# EasyEDA Pro project ProPrj_逆变电路（单相三相）_2026-01-25.epro, board PCB1_1
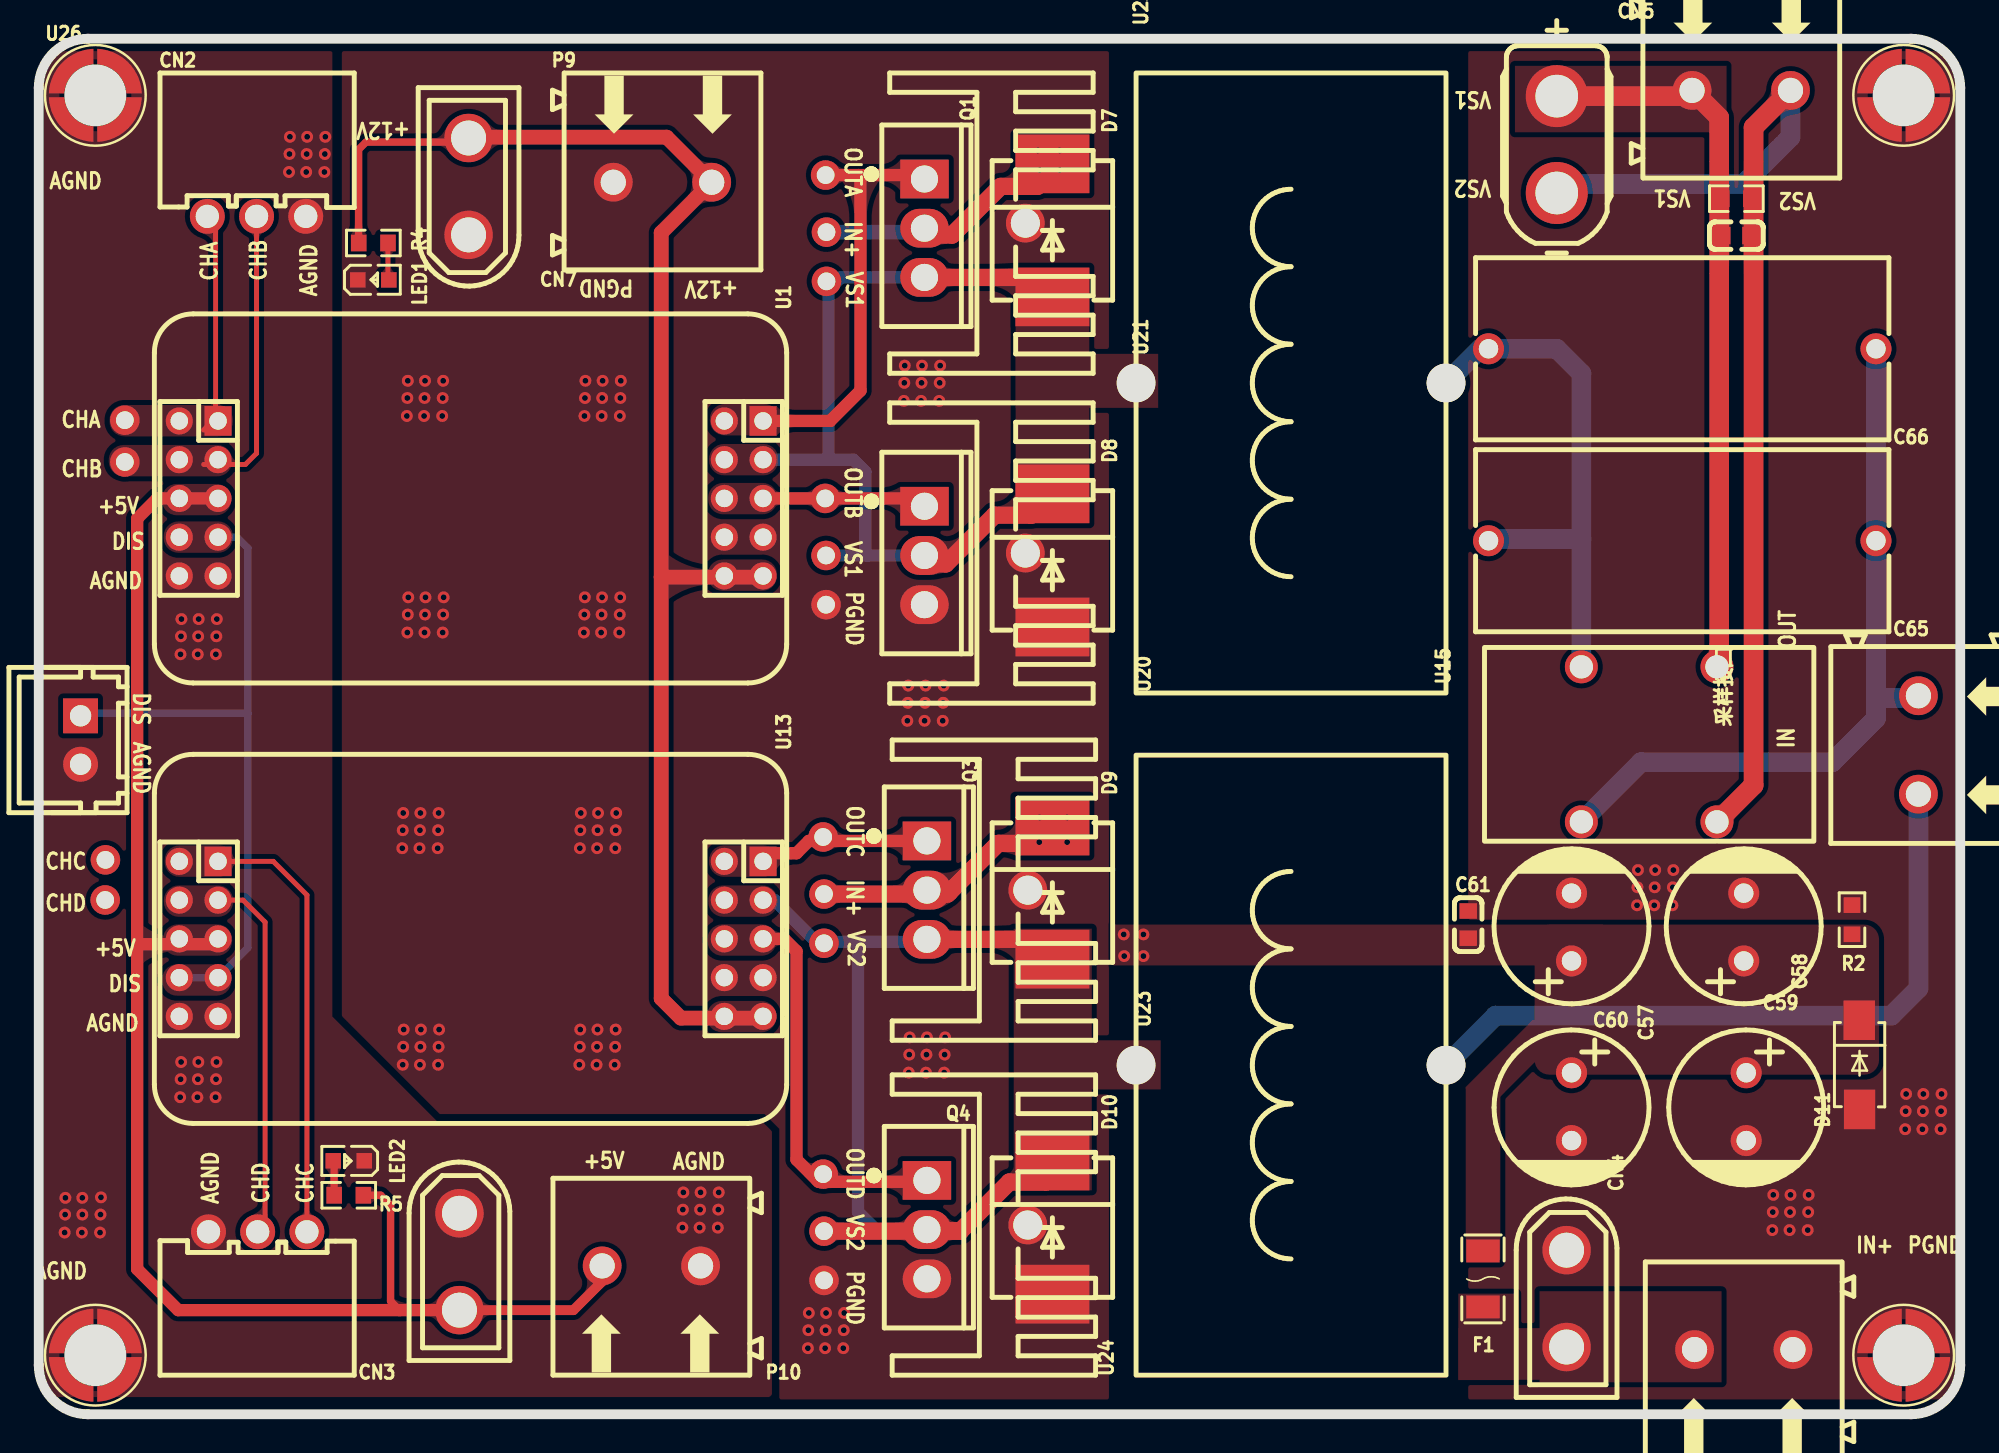
[diagram p5: board, top side]
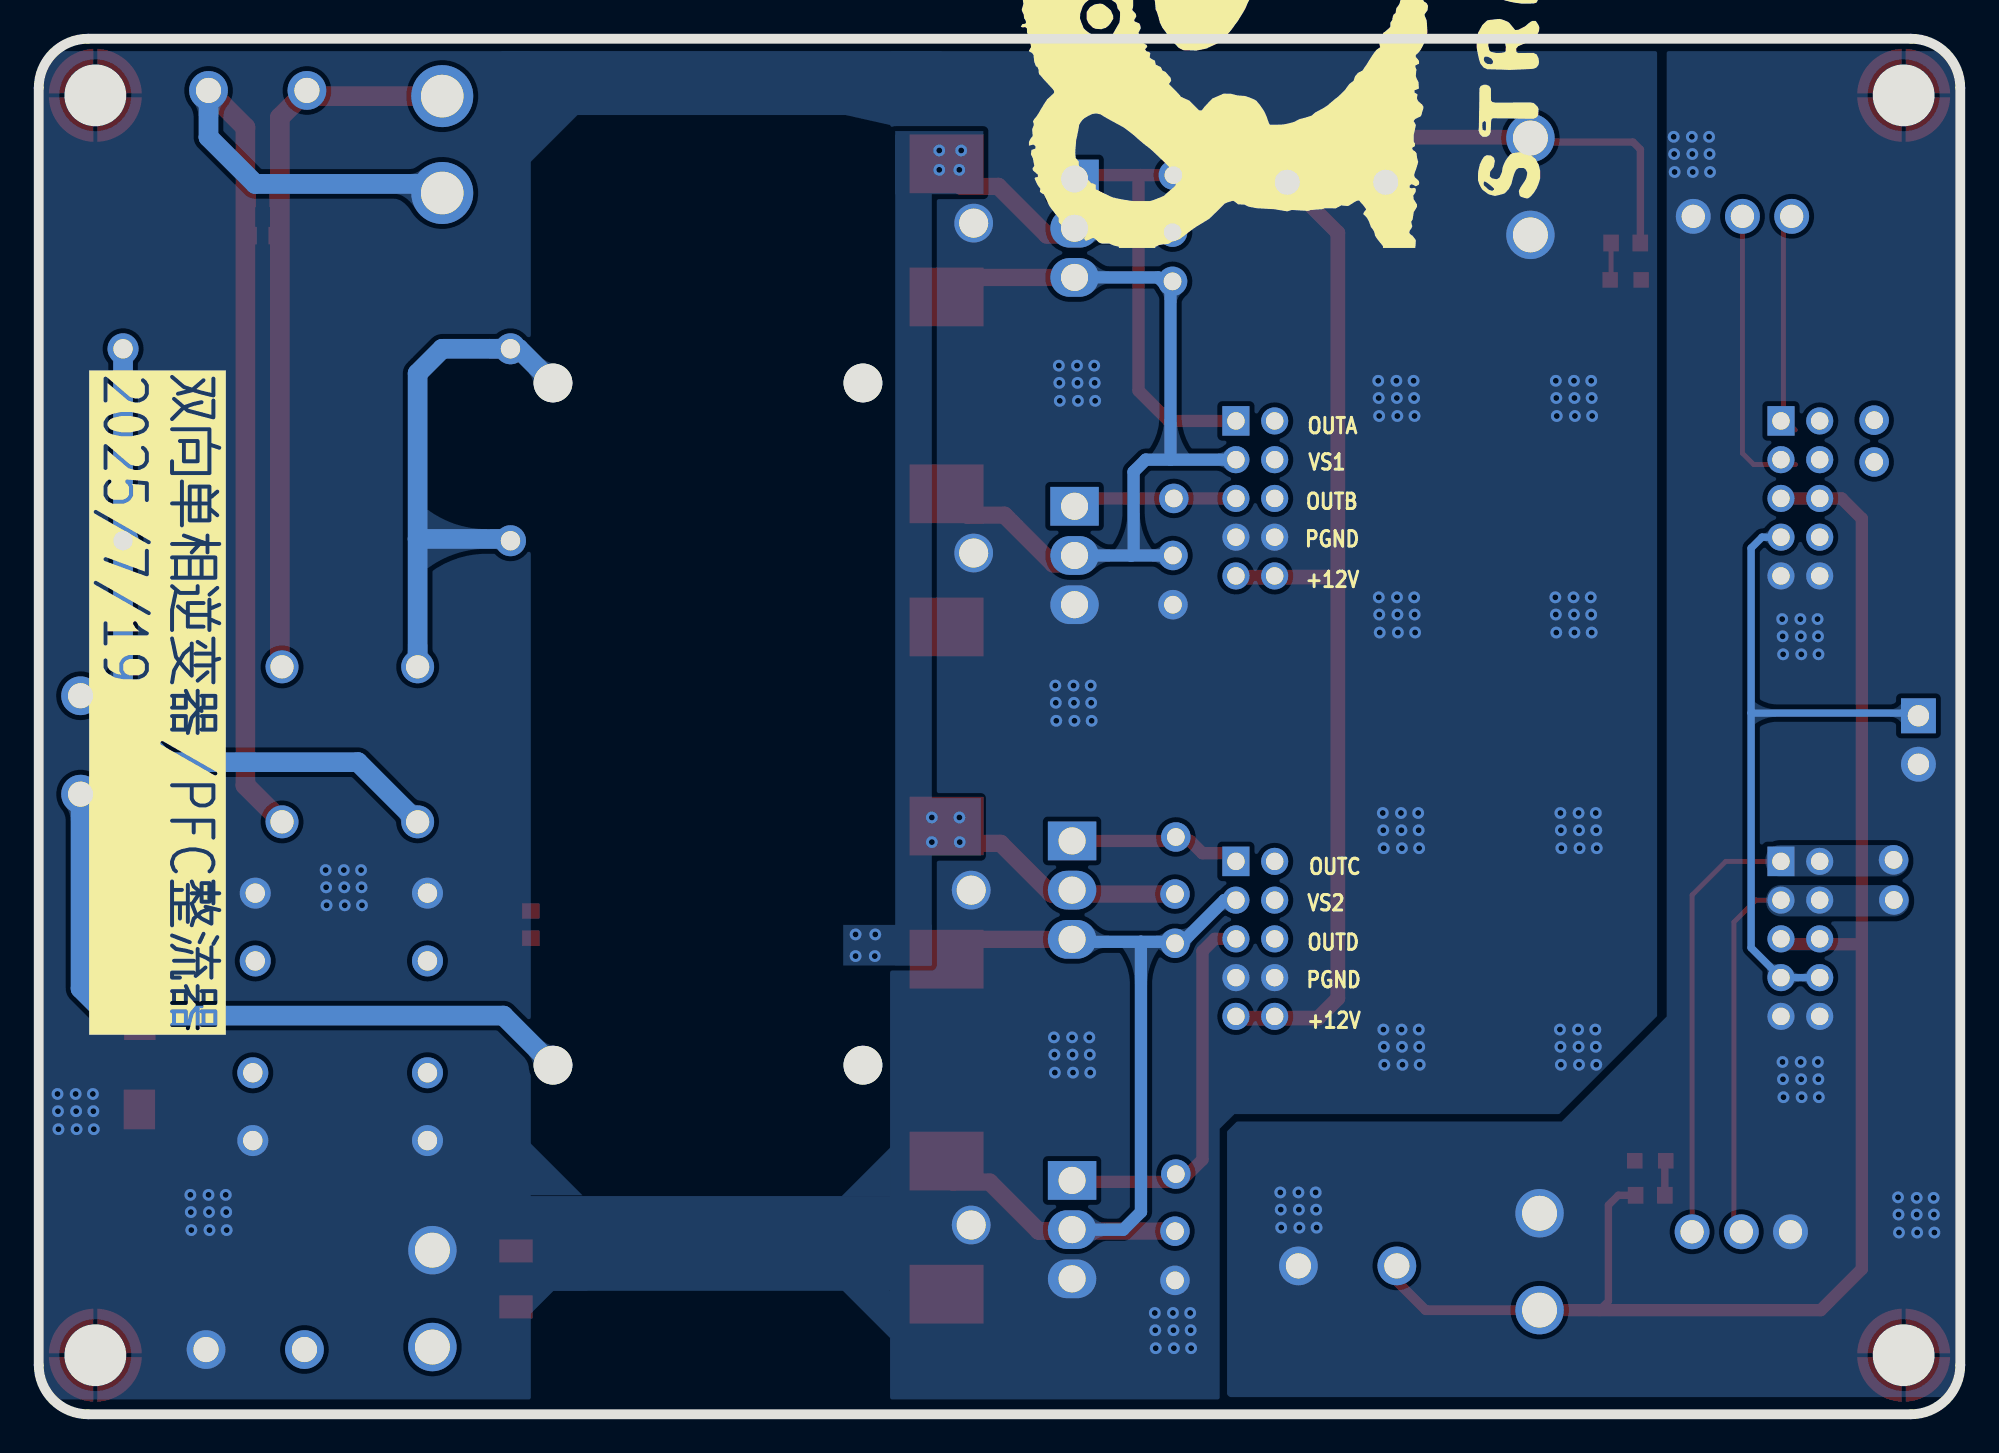
[diagram p6: board, bottom side, seen from below]

Outline 99.19 x 70.99 mm; copper layers: Top Layer, Bottom Layer. Coordinates in mm from the lower left corner of the outline.
Outline path: 0,68.45 0,2.54 arc(0.74,0.74) 2.54,0 96.65,0 arc(98.44,0.74) 99.19,2.54 99.19,68.45 arc(98.44,70.25) 96.65,70.99 2.54,70.99 arc(0.74,70.25) 0,68.45
Stack: Top Layer 0.035mm / Dielectric1 1.51mm FR4 er 4.5 / Bottom Layer 0.035mm

## Design rules (mm)
template: 自定义配置
spacing copperThickness1oz (default): track to track 0.102, other pairs 0.152 to 0.3
spacing copperThickness2oz: track to track 0.203, other pairs 0.152 to 0.3
track width copperThickness1oz (default): min 0.127, default 0.254, max 2.54
track width copperThickness2oz: min 0.203, default 0.254, max 2.54
differential pair differentialPair (default): width min 0.127, default 0.254, max 2.54; gap min 0.152, default 0.152
via viaSize (default): diameter min 0.5, default 0.61, max 10; hole min 0.3, default 0.305, max 6.3

## Placement (name value [footprint] x y rotation side)
C57  470uF  [CAP-TH_BD8.0-P3.50-D0.6-FD_1]  79.12 15.88 270 top
C58  470uF  [CAP-TH_BD8.0-P3.50-D0.6-FD_1]  88.14 15.88 270 top
C59  470uF  [CAP-TH_BD8.0-P3.50-D0.6-FD_1]  88.01 25.15 90 top
C60  470uF  [CAP-TH_BD8.0-P3.50-D0.6-FD_1]  79.12 25.15 90 top
C61  100nF  [C0603]  73.79 25.27 270 top
C64  100nF  [C0603]  87.63 60.83 180 top
C65  2.2uF  [CAP-TH_L21.3-W9.4-P20.00-D1.2]  84.84 45.09 180 top
C66  2.2uF  [CAP-TH_L21.3-W9.4-P20.00-D1.2]  84.84 54.99 180 top
CN2  XH-3AW  [CONN-TH_3P-P2.54_HCTL_XH-3AW]  11.24 61.83 0 top
CN3  XH-3AW  [CONN-TH_3P-P2.54_HCTL_XH-3AW]  11.3 9.42 180 top
CN4  XT30UPB-M  [CONN-TH_XT30UPB-M]  78.87 5.97 270 top
CN5  XT30UPB-F30.G.Y  [CONN-TH_XT30UPB-F]  78.36 65.53 270 top
CN6  ZX-XH2.54-2PZZ  [CONN-TH_2P-P2.50_HX25003-2A]  2.16 34.8 270 top
CN7  XT30UPB-M  [CONN-TH_XT30UPB-M]  22.19 63.37 90 top
CN8  XT30UPB-M  [CONN-TH_XT30UPB-M]  21.72 7.87 270 top
D7  SS510  [SMC_L7.1-W6.2-LS8.1-R-RD]  52.32 61.1 270 top
D8  SS510  [SMC_L7.1-W6.2-LS8.1-R-RD]  52.32 44.07 270 top
D9  SS510  [SMC_L7.1-W6.2-LS8.1-R-RD]  52.32 26.92 270 top
D10  SS510  [SMC_L7.1-W6.2-LS8.1-R-RD]  52.32 9.63 270 top
D11  SS54  [SMA_L4.3-W2.6-LS5.0-FD]  93.98 18.03 90 top
F1  JFC1206-1500FS  [F1206]  74.55 6.99 90 top
LED1  LTST-C190KSKT  [LED0603-RD]  17.27 58.55 0 top
LED2  LTST-C190KSKT  [LED0603-RD]  16 13.08 180 top
NOREF  -  [Pad_e745]  40.54 24.31 0 top
NOREF#2  -  [Pad_e744]  40.54 26.85 0 top
NOREF#3  -  [Pad_e807]  40.66 58.47 0 top
NOREF#4  -  [Pad_e743]  40.49 29.79 0 top
NOREF#5  -  [Pad_e645]  40.6 47.27 0 top
NOREF#6  -  [Pad_e806]  40.66 61.01 0 top
NOREF#7  -  [Pad_e835]  4.45 51.31 0 top
NOREF#8  -  [Pad_e790]  40.49 12.39 0 top
NOREF#9  -  [Pad_e876]  3.43 26.54 0 top
NOREF#10  -  [Pad_e658]  40.64 44.32 0 top
NOREF#11  -  [Pad_e805]  40.62 63.96 0 top
NOREF#12  -  [Pad_e741]  40.64 41.78 0 top
NOREF#13  -  [Pad_e791]  40.54 9.45 0 top
NOREF#14  -  [Pad_e836]  4.45 49.15 0 top
NOREF#15  -  [Pad_e875]  3.44 28.61 0 top
NOREF#16  -  [Pad_e792]  40.54 6.91 0 top
P7  WJ500V-5.08-2P  [CONN-TH_2P-P5.00_WJ500V-5.08-2P]  87.88 68.33 0 top
P8  WJ500V-5.08-2P  [CONN-TH_2P-P5.00_WJ500V-5.08-2P]  88.01 3.34 180 top
P9  WJ500V-5.08-2P  [CONN-TH_2P-P5.00_WJ500V-5.08-2P]  32.2 63.59 0 top
P10  WJ500V-5.08-2P  [CONN-TH_2P-P5.00_WJ500V-5.08-2P]  31.62 7.66 180 top
P11  WJ500V-5.08-2P  [CONN-TH_2P-P5.00_WJ500V-5.08-2P]  97.03 34.54 270 top
Q1  IRF540  [TO-220AB-3_L10.4-W4.6-P2.54-L]  45.72 61.21 270 top
Q2  IRF540  [TO-220AB-3_L10.4-W4.6-P2.54-L]  45.72 44.32 270 top
Q3  IRF540  [TO-220AB-3_L10.4-W4.6-P2.54-L]  45.85 27.05 270 top
Q4  IRF540  [TO-220AB-3_L10.4-W4.6-P2.54-L]  45.85 9.53 270 top
R2  100kΩ  [R0603]  93.6 25.53 270 top
R3  100kΩ  [R0603]  87.63 62.74 180 top
R4  5kΩ  [R0603]  17.27 60.45 0 top
R5  5kΩ  [R0603]  16 11.3 180 top
U1  -  [UCC21520模块]  23.5 47.12 270 top
U13  -  [UCC21520模块]  23.5 24.38 270 top
U14  -  [1mH_14*8*7]  64.64 53.23 90 top
U15  -  [共模电感3mH]  79.63 36.58 0 top
U20  15.5*10.5*21  [SINK-TH_L15.0-W10.5-H21.0]  51.05 27.05 270 top
U21  15.5*10.5*21  [SINK-TH_L15.0-W10.5-H21.0]  50.93 44.45 270 top
U22  15.5*10.5*21  [SINK-TH_L15.0-W10.5-H21.0]  50.93 61.48 270 top
U23  15.5*10.5*21  [SINK-TH_L15.0-W10.5-H21.0]  51.05 9.77 270 top
U24  -  [1mH_14*8*7]  64.64 18.02 90 top
U25  M3x10+6Cu  [SMD_L4.7-W4.7-D3.0]  2.92 3.05 0 top
U26  M3x10+6Cu  [SMD_L4.7-W4.7-D3.0]  2.92 68.07 0 top
U27  M3x10+6Cu  [SMD_L4.7-W4.7-D3.0]  96.27 3.05 0 top
U28  M3x10+6Cu  [SMD_L4.7-W4.7-D3.0]  96.27 68.07 0 top

## Footprints (pads in the part's own frame, mm; a bottom-side part is the same pattern mirrored in y, then rotated)
1mH_14*8*7
  round 2 hole 2x1.5: 1(0,8) 2(0,-8)
C0603
  rect 0.8x0.9 smd: 1(-0.7,0) 2(0.7,0)
CAP-TH_BD8.0-P3.50-D0.6-FD_1
  round 1.6 hole 1: 1(-1.75,0) 2(1.75,0)
CAP-TH_L21.3-W9.4-P20.00-D1.2
  round 1.6 hole 1: 1(-10,0) 2(10,0)
CONN-TH_2P-P2.50_HX25003-2A
  rect 1.8x1.8 hole 1.1: 1(-1.25,0)
  round 1.8 hole 1.1: 2(1.25,0)
CONN-TH_2P-P5.00_WJ500V-5.08-2P
  round 2 hole 1.3: 1(-2.54,0) 2(2.54,0)
CONN-TH_3P-P2.54_HCTL_XH-3AW
  round 1.8 hole 1.199: 1(-2.54,0) 2(0.002,0) 3(2.54,0)
CONN-TH_XT30UPB-F
  round 3.2 hole 2.2: 1(-2.5,0) 2(2.5,0)
CONN-TH_XT30UPB-M
  round 2.5 hole 1.8: 1(-2.5,0) 2(2.5,0)
F1206
  rect 1.19x1.728 smd: 1(-1.445,0) 2(1.445,0)
LED0603-RD
  rect 0.8x0.8 smd: 1(-0.799,0) 2(0.799,0)
Pad_e645
  round 1.524 hole 0.914: 1(0,0)
Pad_e658
  round 1.524 hole 0.914: 1(0,0)
Pad_e741
  round 1.524 hole 0.914: 1(0,0)
Pad_e743
  round 1.524 hole 0.914: 1(0,0)
Pad_e744
  round 1.524 hole 0.914: 1(0,0)
Pad_e745
  round 1.524 hole 0.914: 1(0,0)
Pad_e790
  round 1.524 hole 0.914: 1(0,0)
Pad_e791
  round 1.524 hole 0.914: 1(0,0)
Pad_e792
  round 1.524 hole 0.914: 1(0,0)
Pad_e805
  round 1.524 hole 0.914: 1(0,0)
Pad_e806
  round 1.524 hole 0.914: 1(0,0)
Pad_e807
  round 1.524 hole 0.914: 1(0,0)
Pad_e835
  round 1.524 hole 0.914: 1(0,0)
Pad_e836
  round 1.524 hole 0.914: 2(0,0)
Pad_e875
  round 1.524 hole 0.914: 1(0,0)
Pad_e876
  round 1.524 hole 0.914: 2(0,0)
R0603
  rect 0.806x0.864 smd: 1(-0.753,0) 2(0.753,0)
SINK-TH_L15.0-W10.5-H21.0
  round 2 hole 1.5: 1(0,0)
SMA_L4.3-W2.6-LS5.0-FD
  rect 2.046x1.62 smd: 1(-2.304,-0.009) 2(2.304,0.009)
SMC_L7.1-W6.2-LS8.1-R-RD
  rect 3.03x3.82 smd: 1(3.435,0) 2(-3.435,0)
SMD_L4.7-W4.7-D3.0
  custom 2.3x2.3 smd: 1(-1.25,-1.528) 1(-1.25,1.528) 1(1.25,1.528) 1(1.25,-1.528)
TO-220AB-3_L10.4-W4.6-P2.54-L
  rect 2x2.5 hole 1.4: 1(-2.54,0)
  oval 2x2.5 hole 1.4: 2(0,0) 3(2.54,0)
UCC21520模块
  rect 1.524x1.4 hole 0.9: 1(-4.151,-14.24) 6(-4.151,13.895)
  round 1.4 hole 0.9: 1(-4.151,-16.24) 2(-2.151,-14.24) 2(-2.151,-16.24) 3(-0.151,-14.24) 3(-0.151,-16.24) 4(1.849,-14.24) 4(1.849,-16.24) 5(3.849,-14.24) 5(3.849,-16.24) 6(-4.151,11.895) 7(-2.151,13.895) 7(-2.151,11.895) 8(-0.151,13.895) 8(-0.151,11.895) 9(1.849,13.895) 9(1.849,11.895) 10(3.849,13.895) 10(3.849,11.895)
共模电感3mH
  round 1.7 hole 1.2: 1(0,2) 2(7,2) 3(7,-6) 4(0,-6)

## Nets
+5V: CN8.2 P10.2 R5.1 U1.3 U13.3
+12V: CN7.2 P9.2 R4.1 U1.10 U13.10
AGND: CN2.3 CN3.3 CN6.2 CN8.1 LED2.1 P10.1 U1.5 U13.5 U25.1 U26.1
PGND: C57.2 C58.2 C59.2 C60.2 C61.1 CN4.1 CN7.1 D8.1 D10.1 D11.1 LED1.1 NOREF#12.1 NOREF#16.1 P8.1 P9.1 Q2.3 Q4.3 R2.1 U1.9 U13.9 U20.1 U21.1 U22.1 U23.1 U27.1 U28.1
DIS: CN6.1 U1.4 U13.4
IN+: CN4.2 F1.1 P8.2
OUTA: NOREF#11.1 Q1.1 U1.6
OUTB: NOREF#5.1 Q2.1 U1.8
OUTC: NOREF#4.1 Q3.1 U13.6
OUTD: NOREF#8.1 Q4.1 U13.8
PWMA: CN2.1 NOREF#7.1 U1.1
PWMB: CN2.2 NOREF#14.2 U1.2
PWMC: CN3.1 NOREF#15.1 U13.1
PWMD: CN3.2 NOREF#9.2 U13.2
VS1: D7.1 D8.2 NOREF#3.1 NOREF#10.1 Q1.3 Q2.2 U1.7 U14.1
VS2: D9.1 D10.2 NOREF.1 NOREF#13.1 Q3.3 Q4.2 U13.7 U24.1
$1N14882: C57.1 C58.1 C59.1 C60.1 C61.2 D7.2 D9.2 D11.2 F1.2 NOREF#2.1 NOREF#6.1 Q1.2 Q3.2 R2.2
$1N16777: C64.2 CN5.1 P7.1 R3.2 U15.2
$1N16783: C64.1 CN5.2 P7.2 R3.1 U15.3
$1N17145: C65.2 C66.2 U14.2 U15.1
$1N25469: LED1.2 R4.2
$1N25627: LED2.2 R5.2
$1N25816: P11.2 U24.2
$1N25826: C65.1 C66.1 P11.1 U15.4

## Via types
v1: diameter 0.61, hole 0.305, Top Layer to Bottom Layer, 192 vias

## Routing (per net, layer and track width the routed paths; a pad name or vN(x,y) marks a point on that pad's centre or on a via; arc(x,y) is an arc through that point)
+5V: length 81.2
  Top Layer w0.381: 18.63,5.37 18.16,5.84 18.16,10.8 17.65,11.3 R5.1
  Top Layer w0.508: P10.2 29.08,6.86 27.6,5.37 CN8.2
  Top Layer w0.635: CN8.2 7.2,5.37 5.08,7.49 5.08,24.26 ; U1.3 U1.3 6.12,47.27 5.08,46.23 5.08,24.26 ; 5.08,24.26 8.98,24.26 U13.3
+12V: length 78.5
  Top Layer w0.381: 21.68,65.87 21.64,65.91 21.38,65.66 16.89,65.66 16.51,65.28 16.51,60.46 R4.1
  Top Layer w0.762: U1.10 37.33,43.21 32.13,43.21 ; 32.13,43.21 32.13,60.98 P9.2 32.41,65.91 21.64,65.91 ; 32.13,43.21 32.13,21.46 33.15,20.45 37.3,20.45 U13.10
AGND:
  vias: v1(1.34,9.38) v1(1.38,11.17) v1(1.36,10.31) v1(2.25,11.17) v1(2.25,10.31) v1(2.23,9.38) v1(3.21,11.2) v1(3.19,10.31) v1(3.16,9.38) v1(7.34,40.15) v1(7.32,39.22) v1(7.35,18.18) v1(7.32,17.29) v1(7.3,16.36) v1(7.37,41.04) v1(8.23,40.15) v1(8.21,39.22) v1(8.24,18.18) v1(8.21,17.29) v1(8.19,16.36) v1(8.26,41.04) v1(9.14,39.22) v1(9.15,17.29) v1(9.13,16.36) v1(9.19,41.04) v1(9.17,40.15) v1(9.17,18.18) v1(12.94,65.04) v1(12.92,64.11) v1(12.97,65.93) v1(13.83,65.04) v1(13.81,64.11) v1(13.86,65.93) v1(14.74,64.11) v1(14.79,65.93) v1(14.77,65.04) v1(33.25,10.56) v1(33.23,9.63) v1(33.27,11.45) v1(34.14,10.56) v1(34.11,9.63) v1(34.16,11.45) v1(35.05,9.63) v1(35.1,11.45) v1(35.08,10.56)
PGND:
  vias: v1(18.81,31.03) v1(18.79,30.14) v1(18.77,29.21) v1(18.84,19.86) v1(18.81,18.97) v1(18.79,18.04) v1(19.05,53.34) v1(19.03,52.45) v1(19,51.52) v1(19.05,41.28) v1(19.03,40.35) v1(19.07,42.16) v1(19.65,29.21) v1(19.7,31.03) v1(19.68,30.14) v1(19.73,19.86) v1(19.7,18.97) v1(19.68,18.04) v1(19.94,53.34) v1(19.91,52.45) v1(19.89,51.52) v1(19.94,41.28) v1(19.91,40.35) v1(19.96,42.16) v1(20.64,31.03) v1(20.62,30.14) v1(20.59,29.21) v1(20.64,18.97) v1(20.62,18.04) v1(20.66,19.86) v1(20.85,52.45) v1(20.83,51.52) v1(20.85,40.35) v1(20.88,53.34) v1(20.9,42.16) v1(20.88,41.28) v1(27.93,29.21) v1(27.95,19.86) v1(27.93,18.97) v1(27.9,18.04) v1(27.98,31.03) v1(27.96,30.14) v1(28.14,40.35) v1(28.22,53.34) v1(28.19,52.45) v1(28.17,51.52) v1(28.19,42.16) v1(28.16,41.28) v1(28.85,30.14) v1(28.82,29.21) v1(28.84,19.86) v1(28.82,18.97) v1(28.79,18.04) v1(28.87,31.03) v1(29.05,41.28) v1(29.03,40.35) v1(29.11,53.34) v1(29.08,52.45) v1(29.06,51.52) v1(29.08,42.16) v1(29.75,18.97) v1(29.73,18.04) v1(29.81,31.03) v1(29.78,30.14) v1(29.76,29.21) v1(29.78,19.86) v1(30.05,53.34) v1(30.02,52.45) v1(30,51.52) v1(30.02,42.16) v1(29.99,41.28) v1(29.97,40.35) v1(39.75,5.23) v1(39.73,4.34) v1(39.7,3.41) v1(40.64,5.23) v1(40.62,4.34) v1(40.59,3.41) v1(41.55,4.34) v1(41.53,3.41) v1(41.58,5.23) v1(44.7,54.12) v1(44.68,53.23) v1(44.66,52.3) v1(44.84,35.79) v1(44.89,37.61) v1(44.86,36.72) v1(44.93,18.56) v1(44.91,17.63) v1(44.96,19.45) v1(45.54,52.3) v1(45.59,54.12) v1(45.57,53.23) v1(45.75,36.72) v1(45.73,35.79) v1(45.77,37.61) v1(45.85,19.45) v1(45.82,18.56) v1(45.8,17.63) v1(46.53,54.12) v1(46.51,53.23) v1(46.48,52.3) v1(46.71,37.61) v1(46.69,36.72) v1(46.66,35.79) v1(46.74,17.63) v1(46.78,19.45) v1(46.76,18.56) v1(82.55,28.09) v1(82.53,27.2) v1(82.5,26.27) v1(83.44,28.09) v1(83.41,27.2) v1(83.39,26.27) v1(84.35,27.2) v1(84.33,26.27) v1(84.38,28.09) v1(89.54,11.32) v1(89.51,10.43) v1(89.49,9.5) v1(90.42,11.32) v1(90.4,10.43) v1(90.38,9.5) v1(91.34,10.43) v1(91.31,9.5) v1(91.36,11.32) v1(96.34,14.71) v1(96.39,16.53) v1(96.37,15.64) v1(97.23,14.71) v1(97.28,16.53) v1(97.26,15.64) v1(98.22,16.53) v1(98.2,15.64) v1(98.17,14.71)
DIS: length 35.3
  Bottom Layer w0.381: U1.4 10.23,45.27 10.8,44.7 10.8,36.19 ; U13.4 U13.4 10.8,24.08 10.8,36.19 ; 10.8,36.19 2.3,36.19 CN6.1
OUTA: length 22
  Top Layer w0.635: Q1.1 45.52,63.96 42.31,63.96 ; U1.6 40.85,51.27 42.42,52.83 42.42,63.85 42.31,63.96 ; 42.31,63.96 NOREF#11.1
OUTB: length 8.5
  Top Layer w0.635: 45.72,46.86 45.32,47.27 NOREF#5.1 U1.8
OUTC: length 8.9
  Top Layer w0.635: Q3.1 39.75,29.59 39.12,28.96 37.81,28.96 U13.6
OUTD: length 20
  Top Layer w0.635: U13.8 38.48,24.53 39.12,23.9 39.12,13.14 40.26,12 45.78,12 Q4.1
PWMA: length 11.5
  Top Layer w0.254: CN2.1 9.13,61.4 9.13,51.42 8.51,50.8
PWMB: length 15.2
  Top Layer w0.254: CN2.2 11.24,49.6 10.67,49.02 8.51,49.02
PWMC: length 22.7
  Top Layer w0.254: U13.1 12.11,28.53 13.84,26.8 CN3.1
PWMD: length 19
  Top Layer w0.254: CN3.2 11.68,9.8 11.68,25.4 10.55,26.53 U13.2
VS1: length 43.9
  Top Layer w0.889: Q1.3 51.32,58.67 D7.1 ; 45.66,43.99 45.76,43.89 46.83,43.89 49.34,46.4 51.24,46.4 52.13,47.3
  Bottom Layer w0.635: 42.8,44.32 42.67,44.45 42.67,48.64 42.05,49.27 40.77,49.27 ; 42.8,44.32 Q2.2 ; 42.8,44.32 NOREF#10.1 ; U1.7 40.77,49.27 ; 40.77,49.27 40.77,58.04 41.4,58.67 Q1.3
VS2: length 49.2
  Top Layer w0.889: D9.1 51.3,24.51 Q3.3 ; 47.59,9.47 46.52,9.47 46.42,9.57 ; 47.59,9.47 50.1,11.98 52,11.98 52.9,12.88 ; 47.59,9.47 47.57,9.45 NOREF#13.1
  Bottom Layer w0.635: Q3.3 45.72,24.38 42.29,24.38 ; U13.7 37.98,26.53 40.13,24.38 42.29,24.38 ; 42.29,24.38 42.29,10.44 43.21,9.53 45.84,9.53 Q4.2
$1N14882: length 27.5
  Top Layer w0.889: 52.45,64.27 51.56,63.37 49.66,63.37 47.14,60.86 46.07,60.86 45.97,60.96 ; 52.32,30.36 51.43,29.46 49.53,29.46 47.02,26.95 ; Q3.2 45.95,26.95 47.02,26.95 ; 47.02,26.95 46.91,26.85 NOREF#2.1
  Bottom Layer w0.762: Q1.2 45.52,61.01 NOREF#6.1
  vias: v1(51.57,65.23) v1(51.65,29.53) v1(51.67,64.23) v1(51.67,30.8) v1(52.7,65.23) v1(52.7,64.23) v1(53.09,30.8) v1(53.09,29.53) v1(56.01,24.77) v1(56.03,23.65) v1(57.02,24.77) v1(57.02,23.65)
$1N16777: length 37.7
  Top Layer w1.016: U15.2 86.74,38.69 86.74,66.93 85.64,68.03 ; 85.64,68.03 CN5.1 ; 85.64,68.03 P7.1
$1N16783: length 55
  Top Layer w1.016: P7.2 88.52,66.42 88.52,32.47 U15.3
  Bottom Layer w1.016: CN5.2 78.83,63.5 88.01,63.5 90.42,65.91 P7.2
$1N17145: length 28.2
  Bottom Layer w1.016: U14.2 74.41,54.99 C66.2 78.36,54.99 79.63,53.72 79.63,45.18 ; U15.1 79.63,45.18 ; 79.63,45.18 74.93,45.18 C65.2
$1N25469: length 1.9
  Top Layer w0.254: LED1.2 18.03,58.59 R4.2
$1N25627: length 1.8
  Top Layer w0.381: LED2.2 15.25,13.03 R5.2
$1N25816: length 36.1
  Bottom Layer w1.016: U24.2 75.2,20.57 95.63,20.57 97.03,21.97 P11.2
$1N25826: length 38.7
  Bottom Layer w1.016: P11.1 96.92,36.97 94.84,36.97 ; U15.4 82.71,33.66 92.58,33.66 94.84,35.91 94.84,36.97 ; 94.84,36.97 C65.1 C66.1

## Copper pours and planes (outline as drawn; the poured copper is in the pictures)
+5V on Top Layer: 6.41,25.28 9.98,25.28 9.98,23.67 6.41,23.67
+5V on Top Layer: 6.36,48.02 9.93,48.02 9.93,46.4 6.36,46.4
+12V on Top Layer: 34.5,21.33 38.07,21.33 38.07,19.71 34.5,19.71
+12V on Top Layer: 34.54,44.12 38.11,44.12 38.11,42.5 34.54,42.5
AGND on Top Layer: 6.34,44.07 9.91,44.07 9.91,42.45 6.34,42.45
AGND on Top Layer: 15.16,70.36 15.16,20.53 20.57,15.11 37.34,15.11 37.85,14.61 37.85,1.02 37.72,0.89 -0.76,0.89 -1.78,-0.13 -1.78,70.36
AGND on Top Layer: 6.39,21.33 9.96,21.33 9.96,19.71 6.39,19.71
AGND on Bottom Layer: 15.16,70.36 15.16,20.53 20.57,15.11 37.34,15.11 37.85,14.61 37.85,1.02 37.72,0.89 -0.76,0.89 -1.91,-0.25 -1.91,70.36
PGND on Top Layer: 34.48,23.22 38.05,23.22 38.05,21.6 34.48,21.6
PGND on Top Layer: 15.65,70.36 15.65,20.55 20.7,15.49 37.47,15.49 38.23,14.73 38.23,0.76 99.95,0.76 99.95,70.36
PGND on Top Layer: 34.52,46.01 38.09,46.01 38.09,44.39 34.52,44.39
PGND on Bottom Layer: 49.38,11.26 80.9,11.26 80.9,6.37 49.38,6.37
PGND on Bottom Layer: 54.61,67.69 57.53,67.69 57.53,66.48 54.61,66.48
PGND on Bottom Layer: 15.65,70.36 15.65,20.55 20.7,15.49 37.47,15.49 38.23,14.73 38.23,0.76 99.95,0.76 99.95,70.36
PGND on Bottom Layer: 71.12,14.1 74.3,14.1 74.3,11.3 71.12,11.3
PGND on Bottom Layer: 70.36,68.2 74.93,68.2 74.93,63.88 70.36,63.88
PGND on Bottom Layer: 55.11,6.48 57.79,6.48 57.79,3.94 55.11,3.94
PGND on Bottom Layer: 70.85,6.99 74.77,6.99 74.77,4.21 70.85,4.21
PGND on Bottom Layer: 54.61,13.84 57.74,13.84 57.74,11.26 54.61,11.26
PGND on Bottom Layer: 52.58,70.36 75.31,70.36 75.31,67.06 52.58,67.06
DIS on Top Layer: 6.37,23.22 9.94,23.22 9.94,21.6 6.37,21.6
DIS on Top Layer: 6.45,46.08 10.02,46.08 10.02,44.46 6.45,44.46
IN+ on Top Layer: 77.47,6.35 86.87,6.35 86.87,1.65 77.47,1.65
IN+ on Top Layer: 73.28,6.22 76.27,6.22 76.27,1.76 73.28,1.76
IN+ on Top Layer: 73.28,4.44 81.19,4.44 81.19,1.78 73.28,1.78
OUTA on Top Layer: 34.64,52.14 38.21,52.14 38.21,50.52 34.64,50.52
OUTB on Top Layer: 34.56,48.07 38.13,48.07 38.13,46.45 34.56,46.45
OUTC on Top Layer: 34.6,29.36 38.17,29.36 38.17,27.74 34.6,27.74
OUTD on Top Layer: 34.52,25.28 38.08,25.28 38.08,23.67 34.52,23.67
PWMA on Top Layer: 3.65,52.09 10.02,52.09 10.02,50.47 3.65,50.47
PWMB on Top Layer: 3.62,50.03 9.98,50.03 9.98,48.41 3.62,48.41
PWMC on Top Layer: 6.5,29.36 10.07,29.36 10.07,27.74 6.5,27.74
PWMC on Bottom Layer: 2.68,29.38 10.06,29.38 10.06,27.76 2.68,27.76
PWMD on Top Layer: 6.46,27.29 10.03,27.29 10.03,25.68 6.46,25.68
PWMD on Bottom Layer: 2.64,27.31 10.02,27.31 10.02,25.69 2.64,25.69
VS1 on Top Layer: 50.43,59.16 54.23,59.16 54.23,46.1 50.43,46.1
VS1 on Top Layer: 50.43,54.73 57.79,54.73 57.79,51.94 50.43,51.94
VS1 on Top Layer: 34.6,50.08 38.17,50.08 38.17,48.46 34.6,48.46
VS2 on Top Layer: 50.4,19.3 57.91,19.3 57.91,16.76 50.4,16.76
VS2 on Top Layer: 50.33,25.06 54.36,25.06 54.36,11.56 50.33,11.56
VS2 on Top Layer: 34.56,27.29 38.13,27.29 38.13,25.68 34.56,25.68
$1N14882 on Top Layer: 77.22,25.27 95,25.27 95,17.53 77.22,17.53
$1N14882 on Top Layer: 73.66,16.89 75.45,16.89 75.45,7.99 73.66,7.99
$1N14882 on Top Layer: 73.66,20.36 80.58,20.36 80.58,15.92 73.66,15.92
$1N14882 on Top Layer: 55.48,25.27 80.75,25.27 80.75,23.16 55.48,23.16
$1N14882 on Bottom Layer: 50.43,66.23 54.98,66.23 54.98,62.97 50.43,62.97
$1N14882 on Bottom Layer: 53.09,25.26 57.66,25.26 57.66,23.16 53.09,23.16
$1N14882 on Bottom Layer: 53.09,66.04 54.98,66.04 54.98,23.16 53.09,23.16
$1N14882 on Bottom Layer: 50.55,31.8 54.74,31.8 54.74,28.83 50.55,28.83
$1N16777 on Top Layer: 76.2,69.6 87.12,69.6 87.12,66.17 76.2,66.17

Small or netless copper shapes (teardrops, artwork), in the pictures only: 84 on Top Layer, 37 on Bottom Layer

## Text on the board
Bottom Silkscreen Layer: OUTC | OUTA | VS1 | VS2 | OUTD | +12V | PGND | OUTB | 双向单相逆变器/PFC整流器 / 2025/7/19
Top Silkscreen Layer: IN | OUT | CHA | AGND | CHB | CHD | CHC | VS1 | VS2 | +12V | PGND | DIS | +5V | OUTA | IN+ | OUTB | OUTC | OUTD | 采样接口
